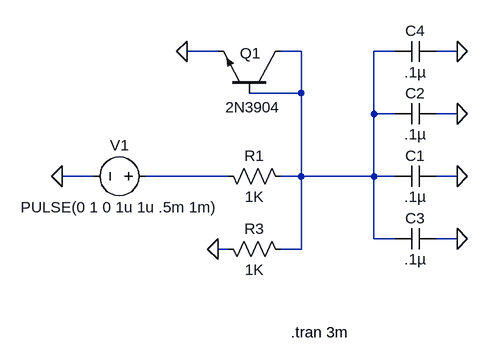
[diagram p0: schematic WireCurrent.asc]
WireCurrent.asc, the LTspice schematic file:
Version 4
SHEET 1 2720 1336
WIRE 1728 576 1680 576
WIRE 1856 576 1824 576
WIRE 2000 576 1968 576
WIRE 2096 576 2064 576
WIRE 1856 640 1856 576
WIRE 1856 640 1776 640
WIRE 1968 672 1968 576
WIRE 2000 672 1968 672
WIRE 2096 672 2064 672
WIRE 1536 768 1488 768
WIRE 1744 768 1616 768
WIRE 1856 768 1856 640
WIRE 1856 768 1824 768
WIRE 1968 768 1968 672
WIRE 1968 768 1856 768
WIRE 2000 768 1968 768
WIRE 2096 768 2064 768
WIRE 1968 864 1968 768
WIRE 2000 864 1968 864
WIRE 2096 864 2064 864
WIRE 1744 880 1728 880
WIRE 1856 880 1856 768
WIRE 1856 880 1824 880
FLAG 1488 768 0
FLAG 2096 768 0
FLAG 2096 672 0
FLAG 2096 864 0
FLAG 1680 576 0
FLAG 1728 880 0
FLAG 2096 576 0
SYMBOL VOLTAGE 1632 768 R90
WINDOW 0 -32 56 VBottom 0
WINDOW 3 32 56 VTop 0
SYMATTR InstName V1
SYMATTR Value PULSE(0 1 0 1u 1u .5m 1m)
SYMATTR SpiceLine RSER=.01
SYMBOL res 1728 752 M90
WINDOW 0 0 56 VBottom 0
WINDOW 3 32 56 VTop 0
SYMATTR InstName R1
SYMATTR Value 1K
SYMBOL cap 2064 752 R90
WINDOW 0 0 32 VBottom 0
WINDOW 3 32 32 VTop 0
SYMATTR InstName C1
SYMATTR Value .1µ
SYMBOL cap 2064 656 R90
WINDOW 0 0 32 VBottom 0
WINDOW 3 32 32 VTop 0
SYMATTR InstName C2
SYMATTR Value .1µ
SYMBOL cap 2064 848 R90
WINDOW 0 0 32 VBottom 0
WINDOW 3 32 32 VTop 0
SYMATTR InstName C3
SYMATTR Value .1µ
SYMBOL res 1728 864 M90
WINDOW 0 0 56 VBottom 0
WINDOW 3 32 56 VTop 0
SYMATTR InstName R3
SYMATTR Value 1K
SYMBOL npn 1824 640 M270
WINDOW 0 46 46 VTop 0
WINDOW 3 -6 42 VBottom 0
SYMATTR InstName Q1
SYMATTR Value 2N3904
SYMBOL cap 2064 560 R90
WINDOW 0 0 32 VBottom 0
WINDOW 3 32 32 VTop 0
SYMATTR InstName C4
SYMATTR Value .1µ
TEXT 1840 1008 Left 0 !.tran 3m

The netlist it stands for:
* WireCurrent.asc
V1 N002 0 PULSE(0 1 0 1u 1u .5m 1m) RSER=.01
R1 N002 N001 1K
C1 0 N001 .1µ
C2 0 N001 .1µ
C3 0 N001 .1µ
R3 0 N001 1K
Q1 N001 N001 0 0 2N3904
C4 0 N001 .1µ
.model NPN NPN
.model PNP PNP
.lib standard.bjt
.tran 3m
.backanno
.end